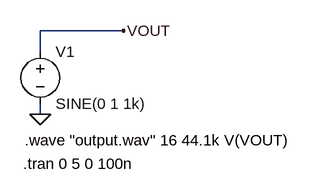
[diagram p0: schematic Audio_output.asc]
Audio_output.asc, the LTspice schematic file:
Version 4
SHEET 1 880 680
WIRE 288 112 160 112
WIRE 160 144 160 112
WIRE 160 240 160 224
FLAG 160 240 0
FLAG 288 112 VOUT
SYMBOL voltage 160 128 R0
WINDOW 123 0 0 Left 0
WINDOW 39 0 0 Left 0
SYMATTR InstName V1
SYMATTR Value SINE(0 1 1k)
TEXT 136 280 Left 2 !.wave "output.wav" 16 44.1k V(VOUT)
TEXT 134 316 Left 2 !.tran 0 5 0 100n

The netlist it stands for:
* Audio_output.asc
V1 VOUT 0 SINE(0 1 1k)
.wave "output.wav" 16 44.1k V(VOUT)
.tran 0 5 0 100n
.backanno
.end